# Altium project Dc-Dc Converters.PrjPcb
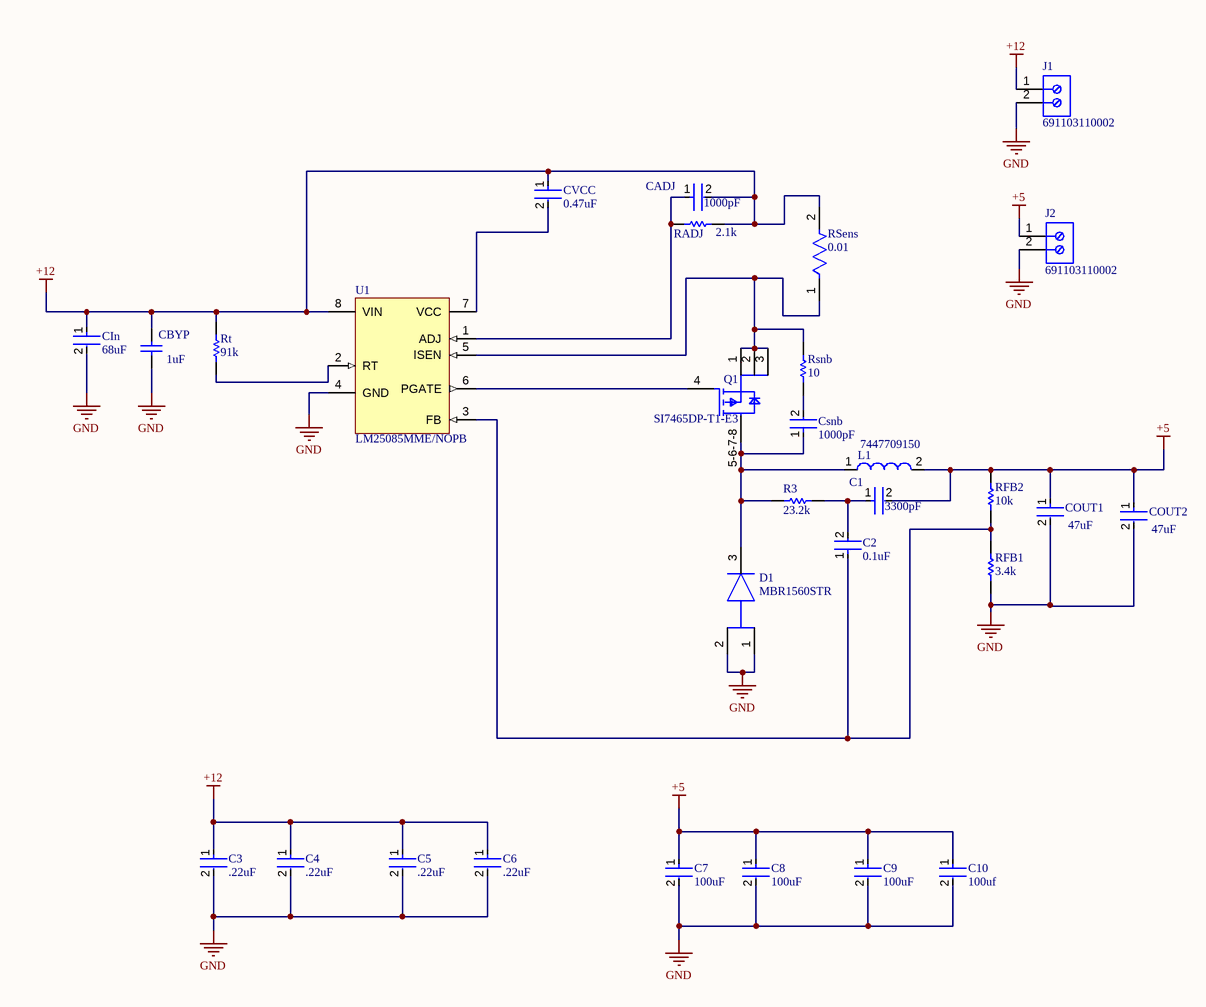
[diagram p0: Dc-Dc Converters.SchDoc]
1 sheet, 30 parts. Net scope: global (net labels, ports and power ports of the same name join across sheets).
Board file: Dc-Dc Converters.PcbDoc

## Sheet Dc-Dc Converters.SchDoc
size 431 x 279 mm; SheetNumber: 1; SheetTotal: 1

### Parts
C1  3300pF  [FP-C0805C-DG-MFG]
C2  0.1uF  [FP-C0805C-DG-MFG]
C3  .22uF  [FP-GRM32-0_3-MFG]
C4  .22uF  [FP-GRM32-0_3-MFG]
C5  .22uF  [FP-GRM32-0_3-MFG]
C6  .22uF  [FP-GRM32-0_3-MFG]
C7  100uF  [FP-GRM32-0_3-MFG]
C8  100uF  [FP-GRM32-0_3-MFG]
C9  100uF  [FP-GRM32-0_3-MFG]
C10  100uf  [FP-GRM32-0_3-MFG]
CADJ  1000pF  [FP-C0805C-DG-MFG]
CBYP  Capacitance: 1uF  [CAPC3216X110X50LL20T25]  (hidden comment: C1206C105K5RACTU)
CIn  68uF  [FP-GRM55D-0_4-IPC_A]
COUT1  value 47uF  [FP-GRM32-0_3-MFG]  (hidden comment: C3225X5R0J476M250AA)
COUT2  value 47uF  [FP-GRM32-0_3-MFG]  (hidden comment: C3225X5R0J476M250AA)
Csnb  1000pF  [FP-C0805C-DG-MFG]
CVCC  0.47uF  [FP-C0805C-DG-MFG]
D1  MBR1560STR  [FP-340BQ-MFG]
J1  691103110002  [691103110002]
J2  691103110002  [691103110002]
L1  7447709150  [WE-PD-XXL]
Q1  SI7465DP-T1-E3  [FP-S17-0173-SINGLE-MFG]
R3  23.2k  [RESC2013X50X30LL20T20]
RADJ  2.1k  [RESC2013X50X30LL20T20]
RFB1  3.4k  [RESC2013X50X30LL20T20]
RFB2  10k  [RESC2013X50X30LL20T20]
RSens  0.01  [FP-CRCW2010-e3-MFG]
Rsnb  10  [RESC2013X50X30LL20T20]
Rt  91k  [RESC2013X50X30LL20T20]
U1  LM25085MME/NOPB  [DGK0008A_M]

### Nets
+5: C1.2 C7.1 C8.1 C9.1 C10.1 COUT1.1 COUT2.1 J2.1 L1.2 RFB2.1
+12: C3.1 C4.1 C5.1 C6.1 CADJ.2 CBYP.2 CIn.1 CVCC.1 J1.1 RADJ.1 RSens.2 Rt.2 U1.8(VIN)
GND: C3.2 C4.2 C5.2 C6.2 C7.2 C8.2 C9.2 C10.2 CBYP.1 CIn.2 COUT1.2 COUT2.2 D1.1(Anode_1) D1.2(Anode_2) J1.2 J2.2 RFB1.1 U1.4(GND)
NetC1_1: C1.1 C2.2 R3.1
NetC2_1: C2.1 RFB1.2 RFB2.2 U1.3(FB)
NetCADJ_1: CADJ.1 RADJ.2 U1.1(ADJ)
NetCsnb_1: Csnb.1 D1.3(C) L1.1 Q1.5-6-7-8(D) R3.2
NetCsnb_2: Csnb.2 Rsnb.2
NetCVCC_2: CVCC.2 U1.7(VCC)
NetQ1_1: Q1.1(S) Q1.2(S) Q1.3(S) RSens.1 Rsnb.1 U1.5(ISEN)
NetQ1_4: Q1.4(G) U1.6(PGATE)
NetRt_1: Rt.1 U1.2(RT)

### Notes on the sheet
- DWG. NO.
- REV.
- SHT.
- THIS DOCUMENT AND THE DATA DISCLOSED HEREIN OR HEREWITH IS THE PROPERTY OF ALTIUM LIMITED AND MAY BE FREELY DISTRIBUTED IN WHOLE. NO RIGHTS ARE RESERVED OR EXPRESS OR IMPLIED WARANTEE GIVEN.
- REVISION
- DESCRIPTION
- DATE
- APPROVED
- ENG:
- APPROVALS
- PROJECT
- DSN:
- CHK:
- REFERENCE DOCUMENTS
- PROJECT REVISION:
- TITLE
- DOCUMENT REVISION:
- DESIGN ITEM:
- BOM:
- FAB DWG:
- PCB DWG:
- ASSY DWG:
- SCALE:
- SIZE
- B
- CAGE CODE
- FILE NAME
- DWG NO.
- SHEET
- OF
- REV

### Library data of the parts
C1 C2 = CMP-2007-03243-2: CAP CER 10UF 10V X5R 0805; Manufacturer Part Number: C0805C106K8PACTU; Manufacturer: Kemet; 3DS Part Number: 220-00001; Tolerance: 10%; Capacitance: 1000pF; Value: 1000pF; Temperature Coefficient: 15%; Material: Ceramic; Device Class L2: Capacitors; Device Class L1: Passive Components; ComponentLink2URL: https://content.kemet.com/datasheets/KEM_C1006_X5R_SMD.pdf; Height: 1.4mm; Lead Free: Yes; Digikey Description: CAP CER 10UF 10V X5R 0805; Octopart: https://octopart.com/c0805c106k8pactu-kemet-98697; Temperature Range Low: -55°C; Temperature: -55°C to +85°C; Automotive: No; Mouser Description: CAP CER 10UF 10V X5R 0805; Ipc Land Pattern Name: CAPC200125X125; Temperature Range High: +85°C; Voltage: 10V; RoHS: TRUE; Device Class L3: Ceramic Capacitors; ComponentLink2Description: Datasheet; Voltage Rating: 10V; Package: C0805C-DG; Temperature Characteristic: X5R; Category: Cap
C3-C10 = CMP-2000-05259-2: CAP CER 100UF 6.3V X5R 1210; 3DS Part Number: 220-00002; Manufacturer Part Number: GRM32ER60J107ME20L; Manufacturer: Murata; Temperature Coefficient: 15%; Material: Ceramic; Tolerance: 20%; Octopart: https://octopart.com/grm32er60j107me20l-murata-197007; ComponentLink2URL: https://search.murata.co.jp/Ceramy/image/img/A01X/G101/ENG/GRM32ER60J107ME20-01.pdf; Temperature Range High: +85°C; RoHS: TRUE; Device Class L3: Ceramic Capacitors; Device Class L2: Capacitors; Voltage: 6.3V; Package: GRM32-0.3; Voltage Rating: 6.3V; Category: Cap; Device Class L1: Passive Components; Temperature Characteristic: X5R; Automotive: No; Digikey Description: CAP CER 100UF 6.3V X5R 1210; Temperature: -55°C to +85°C; Height: 2.7mm; Ipc Land Pattern Name: CAPC320250X250; Capacitance: 100uF; Temperature Range Low: -55°C; Lead Free: Yes; Value: 100uF; ComponentLink2Description: Datasheet
CADJ Csnb CVCC = CMP-2007-03243-2: CAP CER 10UF 10V X5R 0805; Manufacturer Part Number: C0805C106K8PACTU; Manufacturer: Kemet; 3DS Part Number: 220-00001; Tolerance: 10%; Temperature Coefficient: 15%; Device Class L2: Capacitors; Device Class L1: Passive Components; ComponentLink2URL: https://content.kemet.com/datasheets/KEM_C1006_X5R_SMD.pdf; Height: 1.4mm; Lead Free: Yes; Digikey Description: CAP CER 10UF 10V X5R 0805; Octopart: https://octopart.com/c0805c106k8pactu-kemet-98697; Temperature Range Low: -55°C; Temperature: -55°C to +85°C; Automotive: No; Mouser Description: CAP CER 10UF 10V X5R 0805; Ipc Land Pattern Name: CAPC200125X125; Material: Ceramic; Temperature Range High: +85°C; Voltage: 10V; RoHS: TRUE; Device Class L3: Ceramic Capacitors; ComponentLink2Description: Datasheet; Voltage Rating: 10V; Package: C0805C-DG; Temperature Characteristic: X5R; Category: Cap
  CADJ Csnb: Capacitance: 1000pF; Value: 1000pF
  CVCC: Capacitance: 0.47uF; Value: 0.47uF
CBYP = CMP-2000-06011-1: Chip Capacitor, 1 uF, +/- 10%, 50 V, -55 to 125 degC, 1206 (3216 Metric), RoHS, Tape and Reel; Manufacturer: Kemet; Case Height: 1mm; Dielectric: X7R; Voltage Rating: 50V; Temperature Coefficient / Code: +/-15%; Case Length: 3.2mm; Case Width: 1.6mm; Class: Class1; Capacitance - nF: 1000nF; Datasheet URL: http://www.kemet.com/docfinder?Partnumber=C1206C105K5RACTU; Product Category: MultilayerCeramicCapacitorsMLCC-SMD/SMT; Termination Style: SMD/SMT; Dimensions: 1.6mmWx3.2mmLx1mmH; Voltage Rating DC: 50V; Datasheet Version: 02/2016; Packaging: Reel; Brand: Kemet; RoHS: Details; Minimum Operating Temperature: -55C; Operating Temperature Range: -55Cto+125C; Package Reference: 1206; Manufacturer URL: http://www.kemet.com/; Product: GeneralTypeMLCCs; Type: SMDMLCCX7R6.3-250VDCCommericalGrade; Tolerance: 10%; Package Description: 2-Pin Surface Mount Device, Body 3.2 x 1.6 mm; Mounting Technology: SurfaceMount; Case Code - mm: 3216; Maximum Operating Temperature: +125C; Series: C1206C; Factory Pack Quantity: 2500; Package / Case: 1206(3216metric); Case Code - in: 1206
CIn = CMP-2000-06370-2: 100V 2020 pack; Voltage Rating (DC): 250V; Dielectric: X7R; Tolerance: 10%; Width: 5mm; Capacitance: 68uF; Height: 2mm; Case Code (Imperial): 2220; Max Operating Temperature: 125°C; Number of Pins: 2; Min Operating Temperature: -55°C; Termination: SMD/SMT; Case/Package: 2220; Material: Ceramic; REACH SVHC: No SVHC; Voltage: 250V; Packaging: Tape and Reel; Thickness: 0.087inch; Depth: 5mm; Package Quantity: 1; Mount: Surface Mount; Voltage Rating: 250V; Length: 5.7mm; Case Code (Metric): 5750; Lead Free: Lead Free
COUT1 COUT2 = CMP-2000-05259-2: CAP CER 100UF 6.3V X5R 1210; 3DS Part Number: 220-00002; Manufacturer Part Number: GRM32ER60J107ME20L; Manufacturer: Murata; Temperature Coefficient: 15%; Tolerance: 20%; Octopart: https://octopart.com/grm32er60j107me20l-murata-197007; ComponentLink2URL: https://search.murata.co.jp/Ceramy/image/img/A01X/G101/ENG/GRM32ER60J107ME20-01.pdf; Temperature Range High: +85°C; RoHS: TRUE; Device Class L3: Ceramic Capacitors; Device Class L2: Capacitors; Voltage: 6.3V; Package: GRM32-0.3; Voltage Rating: 6.3V; Category: Cap; Device Class L1: Passive Components; Temperature Characteristic: X5R; Automotive: No; Digikey Description: CAP CER 100UF 6.3V X5R 1210; Temperature: -55°C to +85°C; Height: 2.7mm; Ipc Land Pattern Name: CAPC320250X250; Capacitance: 47uF; Material: Ceramic; Temperature Range Low: -55°C; Lead Free: Yes; ComponentLink2Description: Datasheet
D1 = CMP-07162-000018-1: DIODE SCHOTTKY 60V 10A TO277-3; Manufacturer: ON Semiconductor; Manufacturer Part Number: FSV1060V; Max Junction Temp: +150°C; Max Surge Forward Current: 280A; Peak Reverse Current: 0.056mA; Capacitance: 550pF; Value: 550pF; Device Class L2: Diodes; RoHS: TRUE; Lead Free: Yes; Temperature Range High: +150°C; ComponentLink2URL: https://www.onsemi.com/pub/Collateral/FSV1060V-D.pdf; Temperature Range Low: -55°C; Max Repetitive Reverse Voltage: 60V; Footprint Url: https://www.onsemi.com/pub/Collateral/340BQ.PDF; Reverse Voltage: 60V; Device Class L1: Discrete Semiconductors; Octopart: https://octopart.com/fsv1060v-on+semiconductor-84328651; Height: 1.2mm; Digikey Description: DIODE SCHOTTKY 60V 10A TO277-3; ComponentLink2Description: Datasheet; Temperature: -55°C to +150°C; Package: 340BQ; Device Class L3: Schottky Diodes; Forward Current: 10A; Automotive: No; Mouser Description: Schottky Diodes & Rectifiers Schottky; Category: Diode
J1 J2 = CMP-1502-03254-1: Series 1031 - 3.50 mm Horizontal Entry Modular with Pressure Clamp WR-TBL, 2 pin; Manufacturer: Wurth Elektronik; Pin Number: 2; Pitch: 3.50mm; Datasheet URL: http://katalog.we-online.de/em/datasheet/6911031100xx.pdf; Package Reference: 691103110002; Publisher: WurthElektronik; Manufacturer URL: http://www.we-online.de; Mounting Technology: THT; Operating Temperature: -40to105degC; Part Number: 691103110002; Packaging: Box
L1 = CMP-0227-00106-1: SMD-Shielded Power Inductor WE-PD, L = 15.0 µH; Inductance: 15.0 ÂµH; ComponentLink2Description: Datasheet; DatasheetVersion: ver 4, Oct-2006; PackageDescription: SMD Inductor, 2-Leads, Body 12.0 x 12.0 mm; ComponentLink1Description: Manufacturer Link; PackageVersion: 2004; ComponentLink2URL: http://www.we-online.de/katalog/media/pdf/7447709150.pdf; PackageReference: WE-PD-XXL; ComponentLink1URL: http://www.we-online.com
Q1 = CMP-2000-07061-2: MOSFET P-CH 60V 3.2A PPAK SO-8; Manufacturer: Vishay; Gate Charge At Vgs: 275nC @ -10V; Turn On Delay Time: 27ns; Number Of P Channels: 1; Max Forward Diode Voltage: -1.1V; Pulse Drain Current: -100A; Gate To Source Voltage: 20V; Threshold Vgs Max: -2.3V; Drain To Source Resistance: 0.0021Ω; Threshold Vgs Min: -1V; Input Capacitace At Vds: 15660pF @ -15V; Power Dissipation: 6.25W; Standoff Height: 0mm; Continuous Drain Current: -36.5A; Max Junction Temp: +150°C; Typ Forward Diode Voltage: -0.69V; Turn Off Delay Time: 130ns; Drain To Source Breakdown Voltage: -30V; Reverse Recovery Time: 42ns; Depletion Mode: False; Reverse Recovery Charge: 44nC; Rthja Max: 15°C/W; Transconductance: 110S; Temperature Range Low: -55°C; Manufacturer Part Number: SI7465DP-T1-E3; Height: 1.17mm; Automotive: No; Device Class L2: Transistors; Octopart: https://octopart.com/si7145dp-t1-ge3-vishay-42623172; RoHS: TRUE; Device Class L3: MOSFETs; ComponentLink2URL: http://www.vishay.com/docs/64814/si7145dp.pdf; Mouser Description: Single P-Channel 30 V 2.6 mOhms Surface Mount Power Mosfet - PowerPAK SO-8; ComponentLink2Description: Datasheet; Category: Trans; Digikey Description: MOSFET P-CH 30V 60A PPAK SO-8; Number Of Channels: 1; Package: S17-0173-SINGLE; Device Class L1: Discrete Semiconductors; Drain To Source Voltage: -30V; Temperature Range High: +150°C; Temperature: -55°C to +150°C; Lead Free: Yes
R3 RADJ RFB1 RFB2 Rsnb Rt = CMP-2001-04896-1: Manufacturer: Vishay Dale; Part Number: CRCW08050000Z0EA
RSens = CMP-02407-004721-1: RES Thick Film, 49.9Ω, 1%, 0.75W, 100ppm/°C, 2010; Voltage Rating (DC): 400V; Power Rating: 750mW; Resistance: 49.9R; Min Operating Temperature: -55°C; Temperature Coefficient: 100ppm/°C; Length: 5mm; Contact Plating: Tin; Weight: 0.000899oz; Tolerance: 1%; Number of Terminations: 2; Features: Automotive AEC-Q200; Depth: 2.5mm; Package Quantity: 4000; Case Code (Imperial): 2010; Width: 2.5mm; Radiation Hardening: No; Case/Package: 2010; Height: 0.028inch; Lead Free: Lead Free; Packaging: Tape and Reel; Max Operating Temperature: 155°C; Max Power Dissipation: 750mW; Termination: SMD/SMT; Military Standard: Not; Voltage Rating: 400V; Composition: Thick Film; Case Code (Metric): 5025
U1 = CMP-0063-01326-3: 42V Constant On-Time PFET Buck Switching Controller, 8-pin MSOP, Pb-Free; Manufacturer: Texas Instruments; PowerWise: Y; PackageTopMarking: ZXTT*SVZB; CompType: MiscPower; Code_JEDEC: MO-187-AA; PinCount: 8; PackageDescription: MINI SOIC, .118 x .118 x .034in, 8 Lead, .0256in Pitch; PackageReference: DGK0008A; ComponentLink1URL: http://www.ti.com/general/docs/lit/getliterature.tsp?genericPartNumber=LM25085&fileType=pdf; RoHS: Y; ComponentLink1Description: Datasheet URL